# Altium schematic sheet COEXPIX connectors schematics.SchDoc
size A4
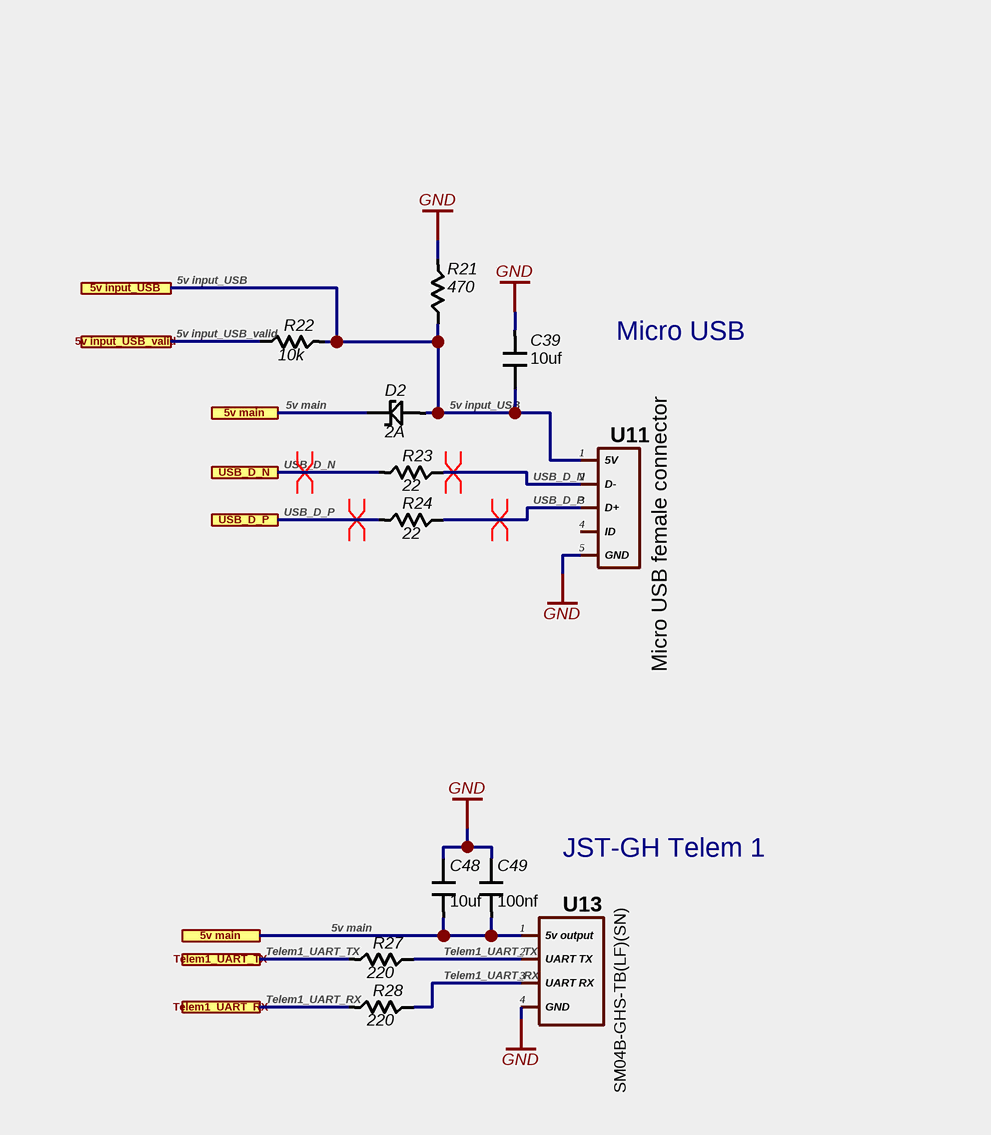
[diagram p0: COEXPIX connectors schematics.SchDoc, top left]
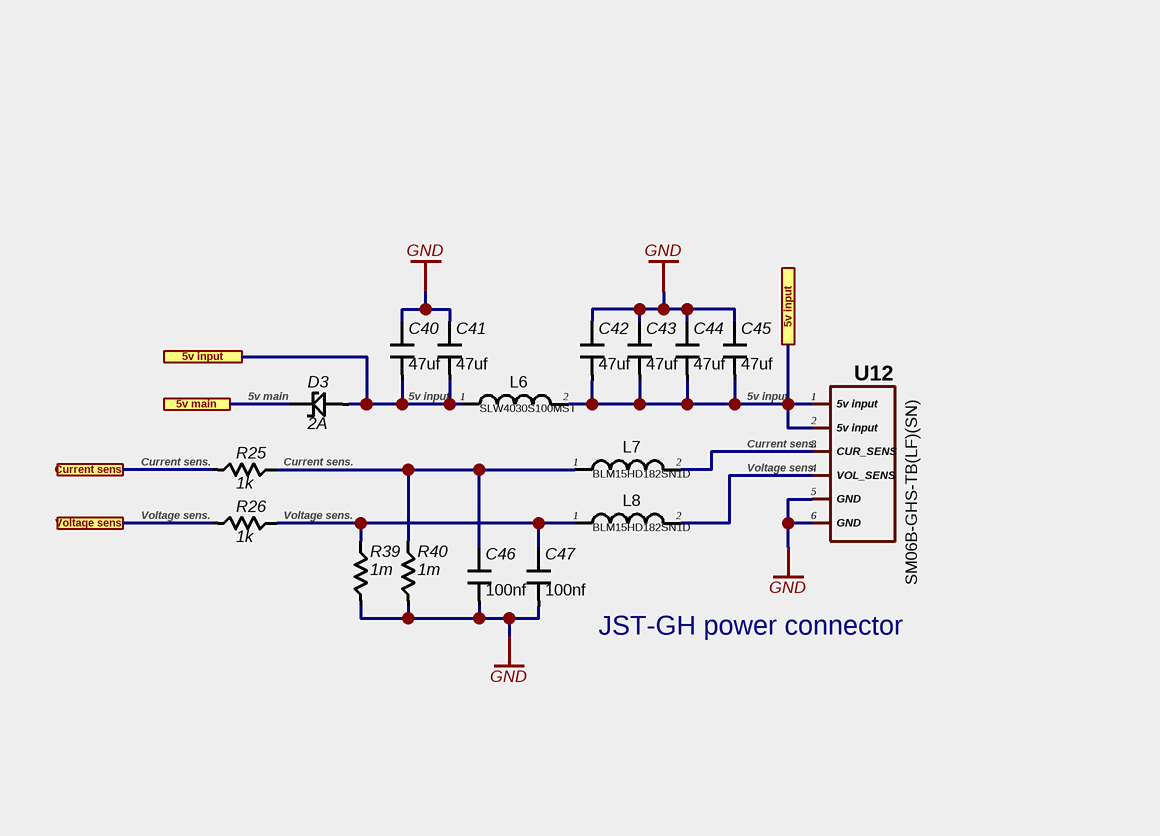
[diagram p1: COEXPIX connectors schematics.SchDoc, top right]
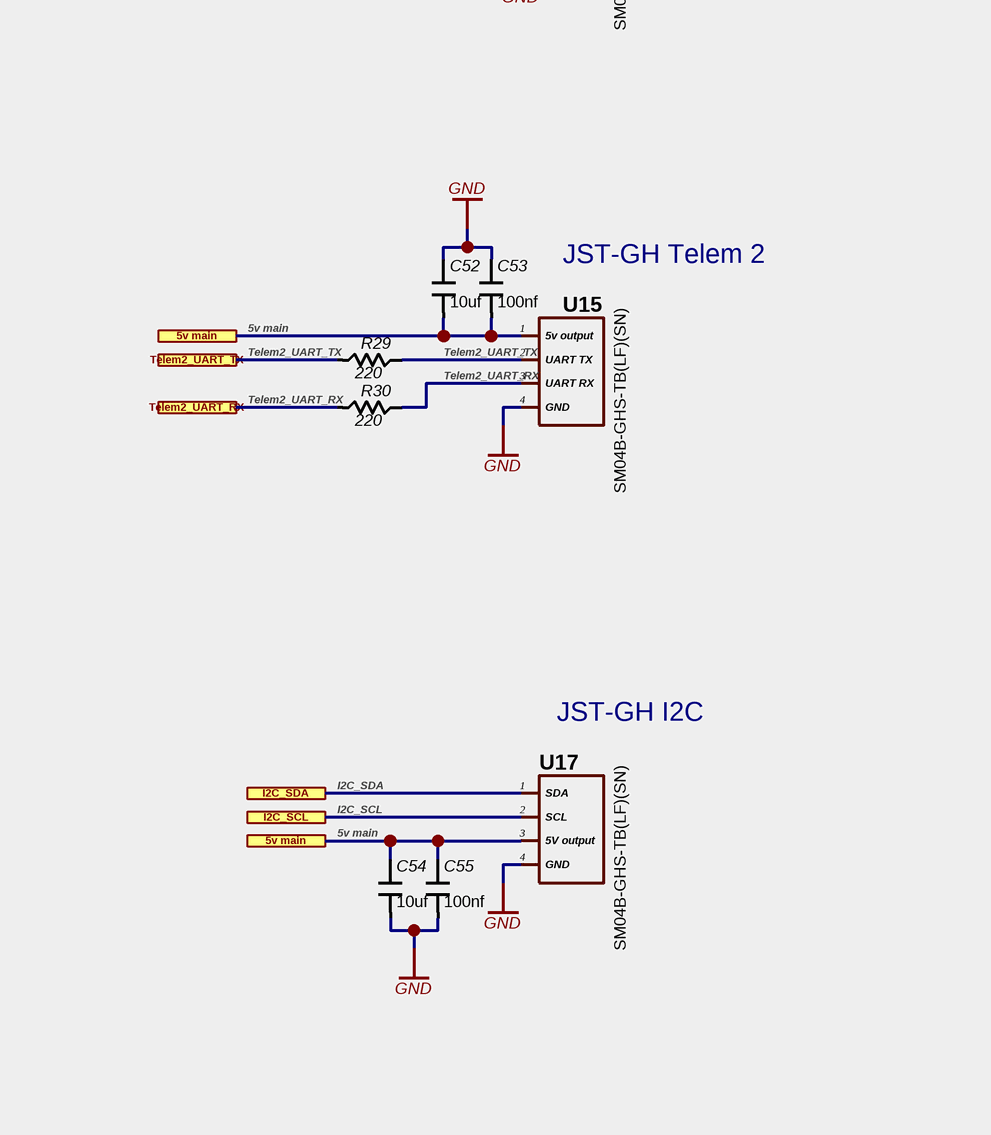
[diagram p2: COEXPIX connectors schematics.SchDoc, bottom left]
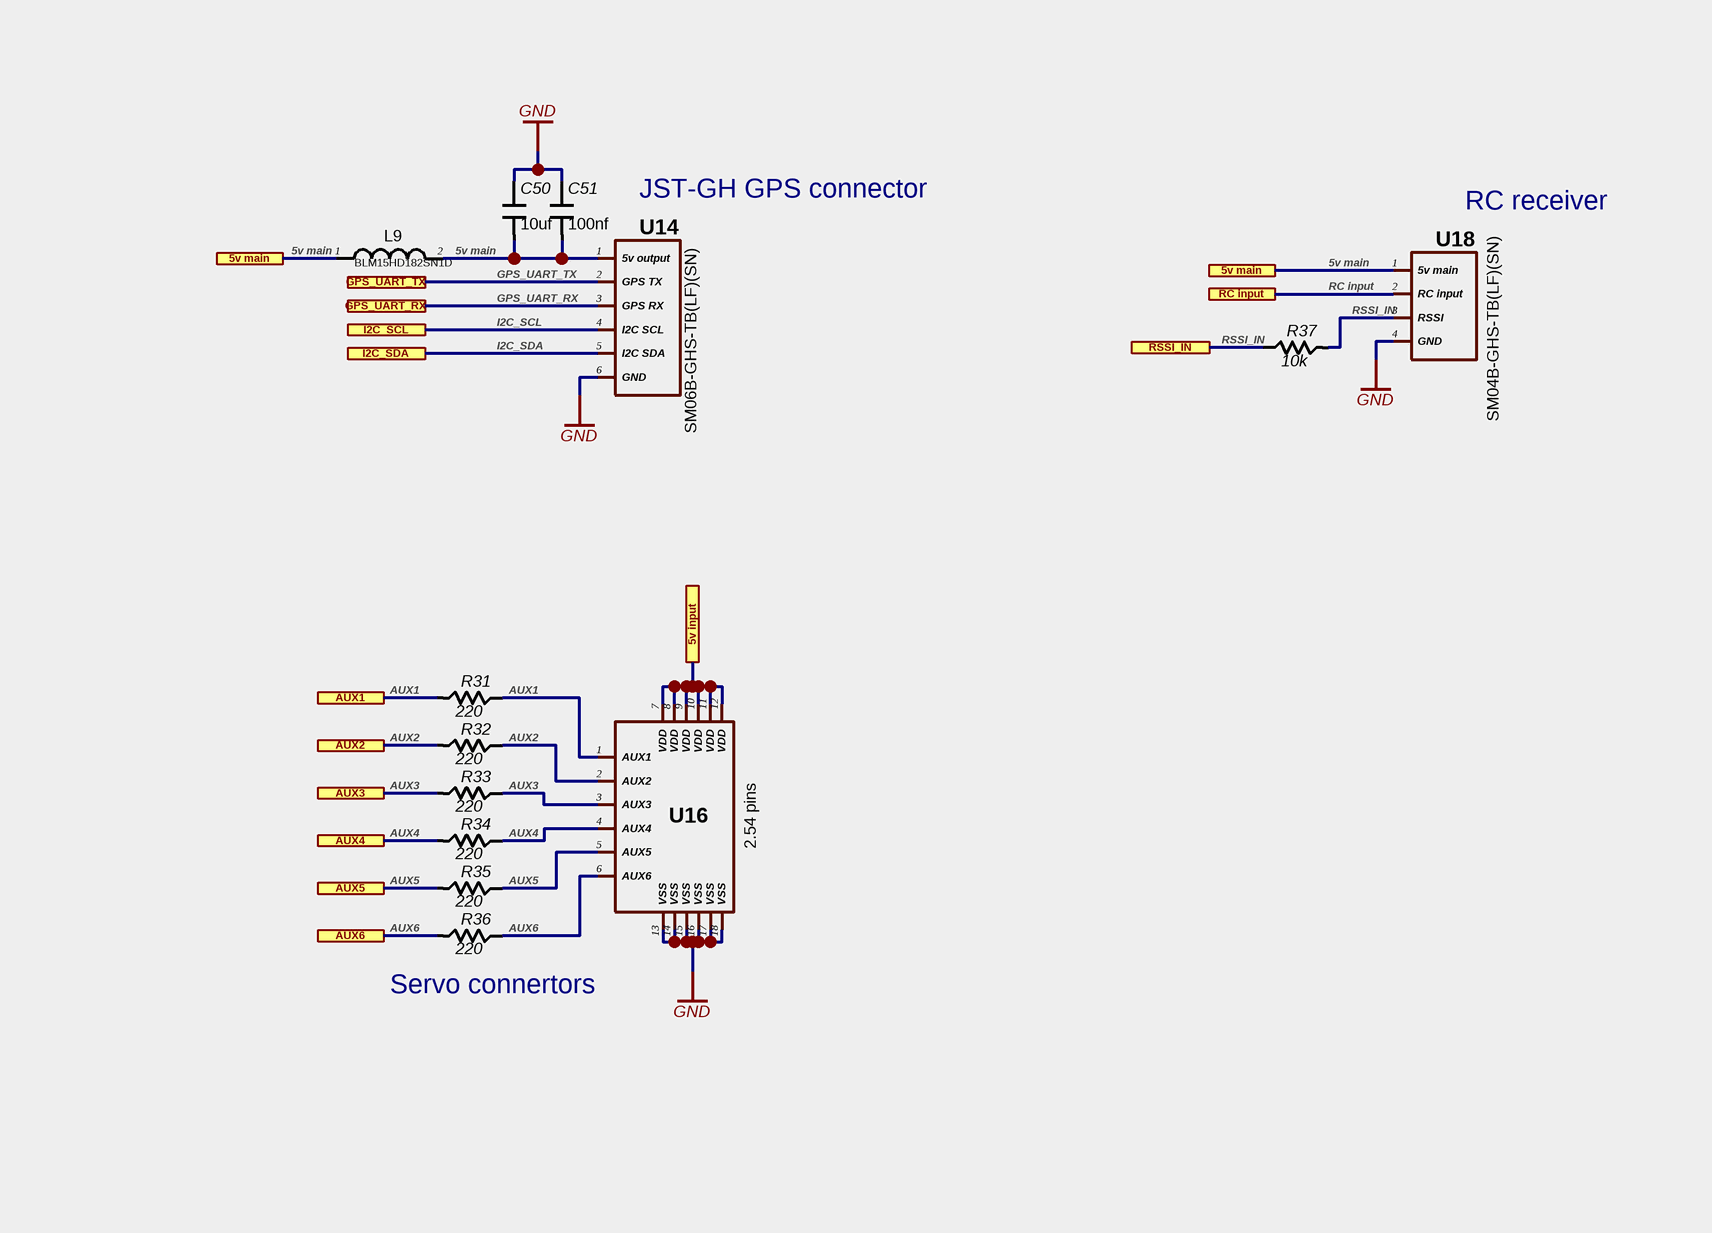
[diagram p3: COEXPIX connectors schematics.SchDoc, bottom right]

## Parts
C39  10uf  [Capasitor 0402]
C40  47uf  [Capasitor 0603]
C41  47uf  [Capasitor 0603]
C42  47uf  [Capasitor 0603]
C43  47uf  [Capasitor 0603]
C44  47uf  [Capasitor 0603]
C45  47uf  [Capasitor 0603]
C46  100nf  [Capasitor 0402]
C47  100nf  [Capasitor 0402]
C48  10uf  [Capasitor 0402]
C49  100nf  [Capasitor 0402]
C50  10uf  [Capasitor 0402]
C51  100nf  [Capasitor 0402]
C52  10uf  [Capasitor 0402]
C53  100nf  [Capasitor 0402]
C54  10uf  [Capasitor 0402]
C55  100nf  [Capasitor 0402]
D2  2A  [SOD-323F]
D3  2A  [SOD-323F]
L6  SLW4030S100MST  [Inductor 4030]
L7  BLM15HD182SN1D  [Ferrite bead 0402]
L8  BLM15HD182SN1D  [Ferrite bead 0402]
L9  BLM15HD182SN1D  [Ferrite bead 0402]
R21  470  [Resistor 0402]
R22  10k  [Resistor 0402]
R23  22  [Resistor 0402]
R24  22  [Resistor 0402]
R25  1k  [Resistor 0402]
R26  1k  [Resistor 0402]
R27  220  [Resistor 0402]
R28  220  [Resistor 0402]
R29  220  [Resistor 0402]
R30  220  [Resistor 0402]
R31  220  [Resistor 0402]
R32  220  [Resistor 0402]
R33  220  [Resistor 0402]
R34  220  [Resistor 0402]
R35  220  [Resistor 0402]
R36  220  [Resistor 0402]
R37  10k  [Resistor 0402]
R39  1m  [Resistor 0402]
R40  1m  [Resistor 0402]
U11  Micro USB female connector  [MicroUSB THREW HOLES]
U12  SM06B-GHS-TB(LF)(SN)  [JST-GH 6 PIN]
U13  SM04B-GHS-TB(LF)(SN)  [JST-GH 4 pin]
U14  SM06B-GHS-TB(LF)(SN)  [JST-GH 6 PIN]
U15  SM04B-GHS-TB(LF)(SN)  [JST-GH 4 pin]
U16  2.54 pins  [3x6 PX4 servo array]
U17  SM04B-GHS-TB(LF)(SN)  [JST-GH 4 pin]
U18  SM04B-GHS-TB(LF)(SN)  [JST-GH 4 pin]

## Ports
5v input, 5v input_USB, 5v input_USB_valid, 5v main, AUX1, AUX2, AUX3, AUX4, AUX5, AUX6, Current sens., GPS_UART_RX, GPS_UART_TX, I2C_SCL, I2C_SDA, RC input, RSSI_IN, Telem1_UART_RX, Telem1_UART_TX, Telem2_UART_RX, Telem2_UART_TX, USB_D_N, USB_D_P, Voltage sens.

## Nets
GND: C39.2 C40.1 C41.1 C42.1 C43.1 C44.1 C45.1 C46.2 C47.2 C48.1 C49.1 C50.1 C51.1 C52.1 C53.1 C54.2 C55.2 R21.2 R39.2 R40.2 U11.5(GND) U12.5(GND) U12.6(GND) U13.4(GND) U14.6(GND) U15.4(GND) U16.13(VSS) U16.14(VSS) U16.15(VSS) U16.16(VSS) U16.17(VSS) U16.18(VSS) U17.4(GND) U18.4(GND)
5v input: C40.2 C41.2 C42.2 C43.2 C44.2 C45.2 D3.2 L6.1 L6.2 U12.1(5v_input) U12.2(5v_input) U16.7(VDD) U16.8(VDD) U16.9(VDD) U16.10(VDD) U16.11(VDD) U16.12(VDD) ; port 5v input
5v input_USB: C39.1 D2.2 R21.1 R22.2 U11.1(5V) ; port 5v input_USB
5v input_USB_valid: R22.1 ; port 5v input_USB_valid
5v main: C48.2 C49.2 C50.2 C51.2 C52.2 C53.2 C54.1 C55.1 D2.1 D3.1 L9.1 L9.2 U13.1(5v_output) U14.1(5v_output) U15.1(5v_output) U17.3(5V_output) U18.1(5v_main) ; port 5v main
AUX1: R31.1 R31.2 U16.1(AUX1) ; port AUX1
AUX2: R32.1 R32.2 U16.2(AUX2) ; port AUX2
AUX3: R33.1 R33.2 U16.3(AUX3) ; port AUX3
AUX4: R34.1 R34.2 U16.4(AUX4) ; port AUX4
AUX5: R35.1 R35.2 U16.5(AUX5) ; port AUX5
AUX6: R36.1 R36.2 U16.6(AUX6) ; port AUX6
Current sens.: C46.1 L7.1 L7.2 R25.1 R25.2 R40.1 U12.3(CUR_SENS) ; port Current sens.
GPS_UART_RX: U14.3(GPS_RX) ; port GPS_UART_RX
GPS_UART_TX: U14.2(GPS_TX) ; port GPS_UART_TX
I2C_SCL: U14.4(I2C_SCL) U17.2(SCL) ; port I2C_SCL
I2C_SDA: U14.5(I2C_SDA) U17.1(SDA) ; port I2C_SDA
RC input: U18.2(RC_input) ; port RC input
RSSI_IN: R37.1 R37.2 U18.3(RSSI) ; port RSSI_IN
Telem1_UART_RX: R28.1 R28.2 U13.3(UART_RX) ; port Telem1_UART_RX
Telem1_UART_TX: R27.1 R27.2 U13.2(UART_TX) ; port Telem1_UART_TX
Telem2_UART_RX: R30.1 R30.2 U15.3(UART_RX) ; port Telem2_UART_RX
Telem2_UART_TX: R29.1 R29.2 U15.2(UART_TX) ; port Telem2_UART_TX
USB_D_N: R23.1 R23.2 U11.2(D-) ; port USB_D_N
USB_D_P: R24.1 R24.2 U11.3(D+) ; port USB_D_P
Voltage sens.: C47.1 L8.1 L8.2 R26.1 R26.2 R39.1 U12.4(VOL_SENS) ; port Voltage sens.

Not connected (* = marked no-connect by the designer): U11 4(ID)

## Layout directives
differential pair: USB_D_N, USB_D_P

## Notes on the sheet
- Micro USB
- JST-GH power connector
- JST-GH Telem 1
- JST-GH GPS connector
- (near U18) RC receiver
- JST-GH Telem 2
- (near U17) JST-GH I2C
- Servo connertors

## Library data of the parts
C39 C48 C50 C52 C54 = Capacitor MLCC: Multilayer Ceramic Capacitors MLCC - SMD/SMT 10uF 6.3V 0402; Part number: JMK105CBJ106MV-F; Manufacturer: Taiyo Yuden; Component package: 0402; HelpURL: https://lcsc.com/product-detail/Multilayer-Ceramic-Capacitors-MLCC-SMD-SMT_TAIYO-YUDEN_JMK105CBJ106MV-F_10uF-106-20-6-3V_C87148.html; Value: 10uf
C40-C45 = Capacitor MLCC: Multilayer Ceramic Capacitors MLCC - SMD/SMT 47uF 6.3V 0603; Part number: GRM188R60J476ME15D; Manufacturer: Murata; Component package: 0603; HelpURL: https://lcsc.com/product-detail/Multilayer-Ceramic-Capacitors-MLCC-SMD-SMT_MuRata_GRM188R60J476ME15D_47uF-476-20-6-3V_C140782.html; Value: 47uf
C46 C47 C49 C51 C53 C55 = Capacitor MLCC: Multilayer Ceramic Capacitors MLCC - SMD/SMT 100nF 16V 0402; Part number: CC0402KRX7R7BB104; Manufacturer: YAGEO; Component package: 0402; HelpURL: https://lcsc.com/product-detail/Multilayer-Ceramic-Capacitors-MLCC-SMD-SMT_100nF-104-10-16V_C60474.html; Value: 100nf
D2 D3 = Schottky barrier diode: Schottky Barrier Diodes (SBD) SOD-323F; Part number: SGP0230SD; Manufacturer: Suzhou Good-Ark Elec; HelpURL: https://lcsc.com/product-detail/Schottky-Barrier-Diodes-SBD_SGP0230SD_C110406.html; Component package: SOD-323F; Value: 2A
L6 = FB / Inductor: Power Inductors 10uH ±20% 1.5A SMD,4x4x3mm; Manufacturer: Sunltech Tech; Component package: SMD,4.0x4.0x3.0mm; Part number: SLW4030S100MST; HelpURL: https://lcsc.com/product-detail/Power-Inductors_Sunltech-Tech-SLW4030S100MST_C182187.html; Value: 10uH
L7-L9 = FB / Inductor: Beads 0402; Manufacturer: Murata Electronics; Component package: 0402; Value: 1.8 kOhm @100MHz; Part number: BLM15HD182SN1D; HelpURL: https://lcsc.com/product-detail/Ferrite-Beads-And-Chips_MuRata_BLM15HD182SN1D_1-8KR-at100MHz_C76888.html
R21 = Resistor: Chip Resistor - Surface Mount 470Ohms ±1% 1/16W 0402; Part number: RC0402FR-07470RL; Manufacturer: YAGEO; Component package: 0402; HelpURL: https://lcsc.com/product-detail/Chip-Resistor-Surface-Mount_470R-470R-1_C114877.html; Value: 470
R22 R37 = Resistor: Chip Resistor - Surface Mount 10KOhms ±1% 1/16W 0402; Part number: RC0402FR-0710KL; Manufacturer: YAGEO; Component package: 0402; HelpURL: https://lcsc.com/product-detail/Chip-Resistor-Surface-Mount_10KR-1002-1_C60490.html; Value: 10k
R23 R24 = Resistor: Chip Resistor - Surface Mount 22Ohms ±1% 1/16W 0402; Part number: RC0402FR-0722RL; Manufacturer: YAGEO; Component package: 0402; HelpURL: https://lcsc.com/product-detail/Chip-Resistor-Surface-Mount_22R-22R0-1_C114765.html; Value: 22
R25 R26 = Resistor: Chip Resistor - Surface Mount 1KOhms ±1% 1/16W 0402; Part number: RC0402FR-071KL; Manufacturer: YAGEO; Component package: 0402; HelpURL: https://lcsc.com/product-detail/Chip-Resistor-Surface-Mount_1KR-1001-1_C106235.html; Value: 1k
R27-R36 = Resistor: Chip Resistor - Surface Mount 220Ohms ±1% 1/16W 040; Part number: 0402WGF2200TCE; Manufacturer: Uniroyal Elec; Component package: 0402; HelpURL: https://lcsc.com/product-detail/Chip-Resistor-Surface-Mount_Uniroyal-Elec-0402WGF2200TCE_C25091.html; Value: 220
R39 R40 = Resistor: 1M ±1% 1/16W ±100ppm/°C 0402 Chip Resistor; Part number: WR04X1004FTL; Manufacturer: Walsin Tech Corp; Component package: 0402; HelpURL: https://lcsc.com/product-detail/Chip-Resistor-Surface-Mount_Walsin-Tech-Corp-WR04X1004FTL_C163817.html; Value: 1m
U11 = Micro USB: USB Connectors SMD; Manufacturer: Jing Extension of the Electronic Co.; HelpURL: https://lcsc.com/product-detail/USB-Connectors_Jing-Extension-of-the-Electronic-Co-Jing-Extension-of-the-Electronic-Co-micro-5PAll-posts-are-not-guided-Flat-welding-High-temperature_C40942.html
U12 U14 = JST-GH 6: Wire To Board / Wire To Wire Connector SMD; Manufacturer: JST Sales America; Part number: SM06B-GHS-TB(LF)(SN); HelpURL: https://lcsc.com/product-detail/Wire-To-Board-Wire-To-Wire-Connector_JST-Sales-America_SM06B-GHS-TB-LF-SN_JST-Sales-America-SM06B-GHS-TB-LF-SN_C133065.html
U13 U15 U17 U18 = JST-GH 4: Wire To Board / Wire To Wire Connector socket P=1.25mm; Manufacturer: JST Sales America; Part number: SM04B-GHS-TB(LF)(SN); HelpURL: https://lcsc.com/product-detail/Wire-To-Board-Wire-To-Wire-Connector_JST-Sales-America_SM04B-GHS-TB-LF-SN_JST-Sales-America-SM04B-GHS-TB-LF-SN_C189895.html; Component package: socket P=1.25mm
U16 = 3x6 dupont pins: Part number: 2.54 pins array; HelpURL: https://ru.aliexpress.com/item/32702387665.html?spm=a2g0s.9042311.0.0.274233edguG5tO